# Altium schematic sheet Micro.SchDoc
size A4; SheetNumber: 7
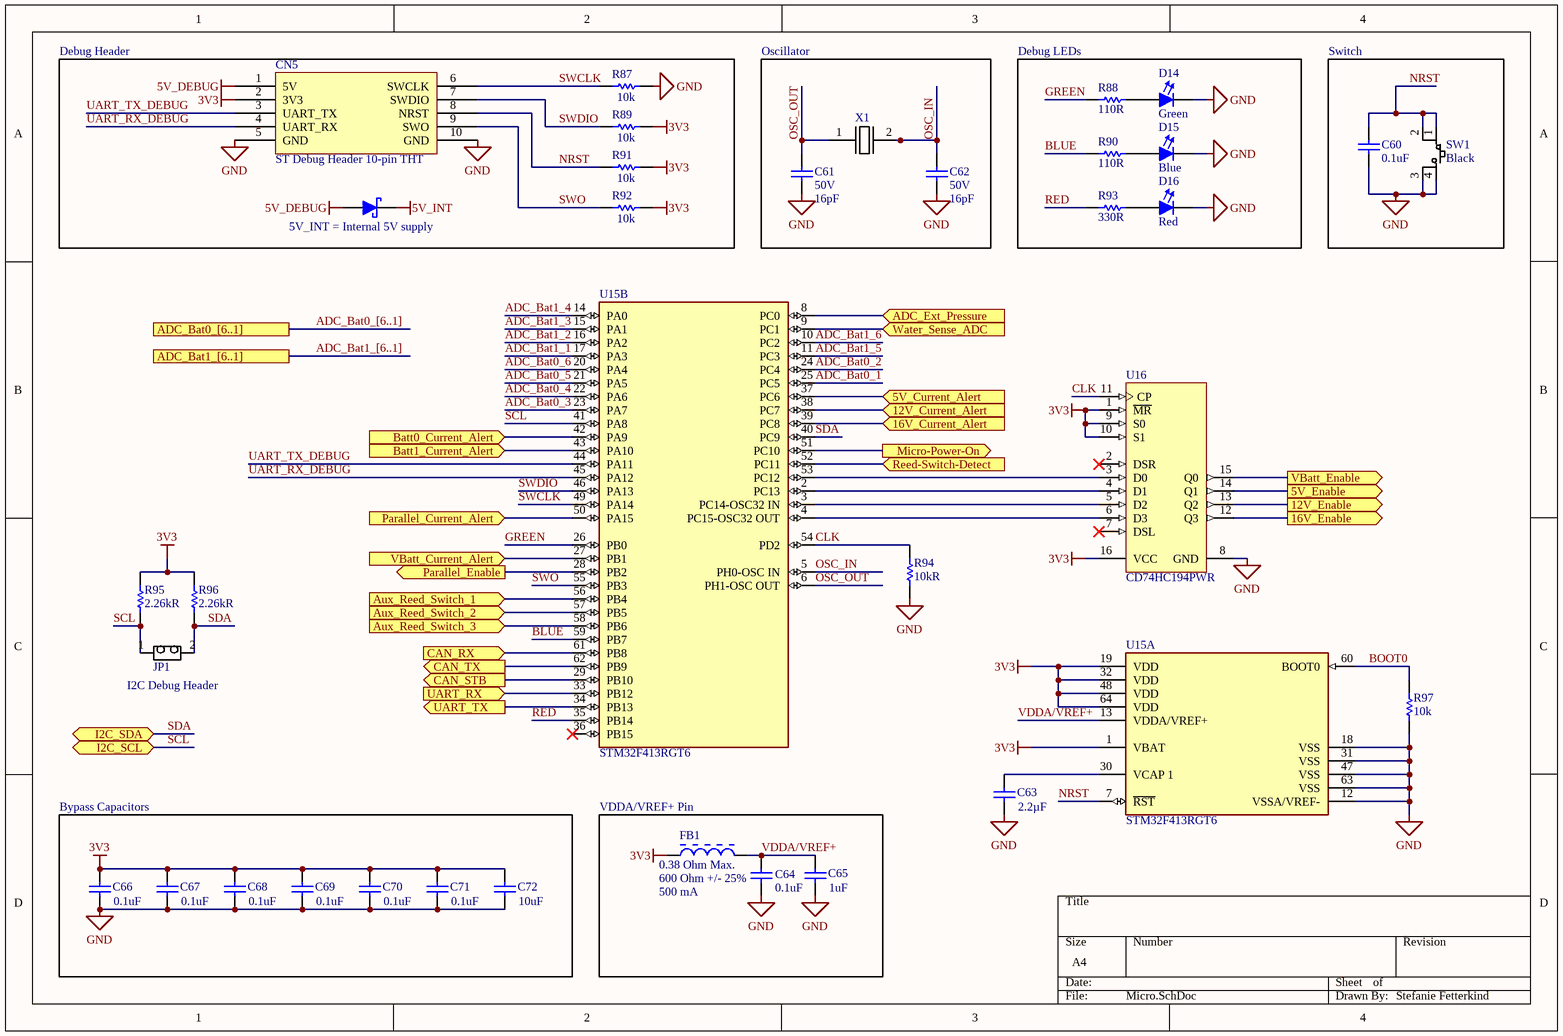
[diagram p0: Micro.SchDoc]

## Parts
C60  Capacitance: 0.1uF  [FP-CL10-0_1-IPC_A]  (hidden comment: CL10B104JB8NNNC)
C61  Voltage: 50V  Capacitance: 16pF  [CAPC1608X90X35LL10T15]  (hidden comment: 16pF Ceramic 50V 5% 0603)
C62  Voltage: 50V  Capacitance: 16pF  [CAPC1608X90X35LL10T15]  (hidden comment: 16pF Ceramic 50V 5% 0603)
C63  value 2.2µF  [CAPC1608N(0603")]  (hidden comment: 2.2uF, 50V, 0603 SMD, X5R, Ceramic)
C64  Capacitance: 0.1uF  [FP-CL10-0_1-IPC_A]  (hidden comment: CL10B104JB8NNNC)
C65  Capacitance: 1uF  [0803 CAP]  (hidden comment: CL21B105KBFNNNG)
C66  Capacitance: 0.1uF  [FP-CL10-0_1-IPC_A]  (hidden comment: CL10B104JB8NNNC)
C67  Capacitance: 0.1uF  [FP-CL10-0_1-IPC_A]  (hidden comment: CL10B104JB8NNNC)
C68  Capacitance: 0.1uF  [FP-CL10-0_1-IPC_A]  (hidden comment: CL10B104JB8NNNC)
C69  Capacitance: 0.1uF  [FP-CL10-0_1-IPC_A]  (hidden comment: CL10B104JB8NNNC)
C70  Capacitance: 0.1uF  [FP-CL10-0_1-IPC_A]  (hidden comment: CL10B104JB8NNNC)
C71  Capacitance: 0.1uF  [FP-CL10-0_1-IPC_A]  (hidden comment: CL10B104JB8NNNC)
C72  Capacitance: 10uF  [CAPC3216X180X50ML20T30]  (hidden comment: CL31B106KBHNNNE)
CN5  ST Debug Header 10-pin THT  [10-pin shrouded header THT]
D14  Color: Green  [FP-LB_Q39E-MFG]  (hidden comment: LT Q39G-Q1OO-25-1)
D15  Color: Blue  [FP-LB_Q39E-MFG]  (hidden comment: LBQ39E-N1OO-35-1)
D16  Color: Red  [FP-LB_Q39E-MFG]  (hidden comment: LSQ976-NR-1)
D17  CUS08F30,H3F  [SC-76]  (value not drawn)
FB1  DC Resistance: 0.38 Ohm Max.  Impedance (at 100 MHz): 600 Ohm +/- 25%  Rated Current: 500 mA  [MURA-BLM18-F-H1-CHIP-2_V]  (hidden comment: BLM18AG601SN1D)
JP1  1x2 Male Header  [2X1 Males Header]  (value not drawn)
R87  value 10k  [RESC1608N(0603")]  (hidden comment: 10kR, 1%, 1/10W, 0603 SMD)
R88  Resistance: 110R  [RESC1608X55X25ML10T15]  (hidden comment: RC0603FR-07110RL)
R89  value 10k  [RESC1608N(0603")]  (hidden comment: 10kR, 1%, 1/10W, 0603 SMD)
R90  Resistance: 110R  [RESC1608X55X25ML10T15]  (hidden comment: RC0603FR-07110RL)
R91  value 10k  [RESC1608N(0603")]  (hidden comment: 10kR, 1%, 1/10W, 0603 SMD)
R92  value 10k  [RESC1608N(0603")]  (hidden comment: 10kR, 1%, 1/10W, 0603 SMD)
R93  Resistance: 330R  [FP-CRCW0603-e3-IPC_A]  (hidden comment: CRCW0603330RFKEA)
R94  Resistance: 10kR  [RESC1608X55X25ML10T15]  (hidden comment: RC0603FR-0710KL)
R95  Resistance: 2.26kR  [RESC0603(1608)_M]  (hidden comment: RC0603FR-072K26L)
R96  Resistance: 2.26kR  [RESC0603(1608)_M]  (hidden comment: RC0603FR-072K26L)
R97  value 10k  [RESC1608N(0603")]  (hidden comment: 10kR, 1%, 1/10W, 0603 SMD)
SW1  Button Colour: Black  [4-SPST-NO]  (hidden comment: PTS645SL43SMTR92LFS)
U15  STM32F413RGT6  [FP-LQFP64-5W-IPC_A]  (parts A,B of 2)
U16  CD74HC194PWR  [PW0016A_M]
X1  Oscillator 8MHz 40ESR  [HC49/US]  (value not drawn)

## Blocks framed on the sheet
Oscillator: C61 C62 X1
Debug LEDs: D14-D16 R88 R90 R93
Switch: C60 SW1
Bypass Capacitors: C66-C72
VDDA/VREF+ Pin: C64 C65 FB1

## Ports
5V_Current_Alert (in), 5V_Enable (out), 12V_Current_Alert (in), 12V_Enable (out), 16V_Current_Alert (in), 16V_Enable (out), ADC_Bat0_[6..1], ADC_Bat1_[6..1], ADC_Ext_Pressure (in), Aux_Reed_Switch_1 (in), Aux_Reed_Switch_2 (in), Aux_Reed_Switch_3 (in), Batt0_Current_Alert (in), Batt1_Current_Alert (in), CAN_RX (in), CAN_STB (out), CAN_TX (out), I2C_SCL (bidir), I2C_SDA (bidir), Micro-Power-On (out), Parallel_Current_Alert (in), Parallel_Enable (out), Reed-Switch-Detect (in), UART_RX (in), UART_TX (out), VBatt_Current_Alert (in), VBatt_Enable (out), Water_Sense_ADC (in)

## Nets
3V3: C66.1 C67.1 C68.1 C69.1 C70.1 C71.1 C72.2 CN5.2(3V3) FB1.1 R89.2 R91.2 R92.2 R95.2 R96.2 U15.1(VBAT) U15.19(VDD) U15.32(VDD) U15.48(VDD) U15.64(VDD) U16.1(~{MR}) U16.9(S0) U16.10(S1) U16.16(VCC)
5V_DEBUG: CN5.1(5V) D17.A(Anode)
5V_INT: D17.K(Cathode)
GND: C60.2 C61.1 C62.1 C63.1(Anode) C64.2 C65.1 C66.2 C67.2 C68.2 C69.2 C70.2 C71.2 C72.1 CN5.5(GND) CN5.10(GND) D14.1(Cathode) D15.1(Cathode) D16.1(Cathode) R87.2 R94.2 R97.1 SW1.3 SW1.4 U15.12(VSSA/VREF-) U15.18(VSS) U15.31(VSS) U15.47(VSS) U15.63(VSS) U16.8(GND)
5V_Current_Alert: U15.37(PC6) ; port 5V_Current_Alert
5V_Enable: U16.14(Q1) ; port 5V_Enable
12V_Current_Alert: U15.38(PC7) ; port 12V_Current_Alert
12V_Enable: U16.13(Q2) ; port 12V_Enable
16V_Current_Alert: U15.39(PC8) ; port 16V_Current_Alert
16V_Enable: U16.12(Q3) ; port 16V_Enable
ADC_Bat0_1: U15.25(PC5)
ADC_Bat0_2: U15.24(PC4)
ADC_Bat0_3: U15.23(PA7)
ADC_Bat0_4: U15.22(PA6)
ADC_Bat0_5: U15.21(PA5)
ADC_Bat0_6: U15.20(PA4)
ADC_Bat1_1: U15.17(PA3)
ADC_Bat1_2: U15.16(PA2)
ADC_Bat1_3: U15.15(PA1)
ADC_Bat1_4: U15.14(PA0)
ADC_Bat1_5: U15.11(PC3)
ADC_Bat1_6: U15.10(PC2)
ADC_Ext_Pressure: U15.8(PC0) ; port ADC_Ext_Pressure
Aux_Reed_Switch_1: U15.56(PB4) ; port Aux_Reed_Switch_1
Aux_Reed_Switch_2: U15.57(PB5) ; port Aux_Reed_Switch_2
Aux_Reed_Switch_3: U15.58(PB6) ; port Aux_Reed_Switch_3
Batt0_Current_Alert: U15.42(PA9) ; port Batt0_Current_Alert
Batt1_Current_Alert: U15.43(PA10) ; port Batt1_Current_Alert
BLUE: R90.2 U15.59(PB7)
BOOT0: R97.2 U15.60(BOOT0)
CAN_RX: U15.61(PB8) ; port CAN_RX
CAN_STB: U15.29(PB10) ; port CAN_STB
CAN_TX: U15.62(PB9) ; port CAN_TX
CLK: R94.1 U15.54(PD2) U16.11(CP)
GREEN: R88.2 U15.26(PB0)
Micro-Power-On: U15.51(PC10) ; port Micro-Power-On
NRST: C60.1 CN5.8(NRST) R91.1 SW1.1 SW1.2 U15.7(~{RST})
OSC_IN: C62.2 U15.5(PH0-OSC_IN) X1.2
OSC_OUT: C61.2 U15.6(PH1-OSC_OUT) X1.1
Parallel_Current_Alert: U15.50(PA15) ; port Parallel_Current_Alert
Parallel_Enable: U15.28(PB2) ; port Parallel_Enable
RED: R93.1 U15.35(PB14)
Reed-Switch-Detect: U15.52(PC11) ; port Reed-Switch-Detect
SCL: JP1.1 R95.1 U15.41(PA8) ; port I2C_SCL
SDA: JP1.2 R96.1 U15.40(PC9) ; port I2C_SDA
SWCLK: CN5.6(SWCLK) R87.1 U15.49(PA14)
SWDIO: CN5.7(SWDIO) R89.1 U15.46(PA13)
SWO: CN5.9(SWO) R92.1 U15.55(PB3)
UART_RX: U15.33(PB12) ; port UART_RX
UART_RX_DEBUG: CN5.4(UART_RX) U15.45(PA12)
UART_TX: U15.34(PB13) ; port UART_TX
UART_TX_DEBUG: CN5.3(UART_TX) U15.44(PA11)
VBatt_Current_Alert: U15.27(PB1) ; port VBatt_Current_Alert
VBatt_Enable: U16.15(Q0) ; port VBatt_Enable
VDDA/VREF+: C64.1 C65.2 FB1.2 U15.13(VDDA/VREF+)
Water_Sense_ADC: U15.9(PC1) ; port Water_Sense_ADC
NetC63_2: C63.2(Cathode) U15.30(VCAP_1)
NetD14_2: D14.2(Anode) R88.1
NetD15_2: D15.2(Anode) R90.1
NetD16_2: D16.2(Anode) R93.2
NetU15_2: U15.2(PC13) U16.4(D1)
NetU15_3: U15.3(PC14-OSC32_IN) U16.5(D2)
NetU15_4: U15.4(PC15-OSC32_OUT) U16.6(D3)
NetU15_53: U15.53(PC12) U16.3(D0)

Not connected (* = marked no-connect by the designer): U15 36(PB15)*; U16 2(DSR)* 7(DSL)*

## Buses and harness runs
bus ADC_Bat0_[6..1] = port ADC_Bat0_[6..1]
bus ADC_Bat1_[6..1] = port ADC_Bat1_[6..1]

## Notes on the sheet
- Debug Header
- (near D17) 5V_INT = Internal 5V supply
- (near JP1) I2C Debug Header
- Stefanie Fetterkind

## Library data of the parts
C60 = CMP-00000-4: CAP CER 0.1UF 50V X7R 0603; Tolerance: 5%; Material: Ceramic; Case Code (Imperial): 0603; Mount: Surface Mount; Thickness: 0.035inch; Depth: 0.8mm; Packaging: Tape and Reel; Package Quantity: 1; Dielectric: X7R; Height: 0.8mm; Voltage: 50V; Radiation Hardening: No; Max Operating Temperature: 125°C; Voltage Rating: 50V; Case/Package: 0603; Min Operating Temperature: -55°C; Case Code (Metric): 1608; Length: 1.6mm; Contact Plating: Tin; Width: 0.031inch
C61 C62 = CMP-00087-2: Cap Ceramic 16pF 50V C0G 5% SMD 0603 125C Paper T/R; Temperature Coefficient: 30ppm/°C; Termination: SMD/SMT; Voltage Rating: 50V; Dielectric: C0G; Radiation Hardening: No; Voltage Rating (DC): 50V; Max Operating Temperature: 125°C; Height: 0.8mm; Width: 0.8mm; Length: 1.6mm; Package Quantity: 1; Lead Free: Lead Free; Min Operating Temperature: -55°C; Case Code (Metric): 1608; Case/Package: 0603; Tolerance: 5%; Mount: Surface Mount; Thickness: 0.035inch; Case Code (Imperial): 0603; Depth: 0.8mm; Packaging: Tape and Reel
C63 = CMP-006-0030-1: Capacitor, Ceramic, 50V, 10%, 0603 SMD, X5R; Date Created: *; Design Item ID: 2.2uF, 50V, 0603 SMD, X5R, Ceramic; Made By: *; Publisher: AUVic; Source: AUVic_Schematic_Library_Capacitors.SchLib; Pin Count: 2; PackageDescription: Chip Capacitor; Component Type: Standard
C64 C66-C71 = CMP-00000-4: CAP CER 0.1UF 50V X7R 0603; Material: Ceramic; Tolerance: 5%; Dielectric: X7R; Width: 0.031inch; Min Operating Temperature: -55°C; Contact Plating: Tin; Length: 1.6mm; Case/Package: 0603; Package Quantity: 1; Voltage Rating: 50V; Voltage: 50V; Radiation Hardening: No; Packaging: Tape and Reel; Max Operating Temperature: 125°C; Case Code (Imperial): 0603; Thickness: 0.035inch; Case Code (Metric): 1608; Height: 0.8mm; Mount: Surface Mount; Depth: 0.8mm
C65 = CMP-00005-3: SAMSUNG ELECTRO-MECHANICS - CL21B105KBFNNNG - MLCC CAPACITORS; Tolerance: 10%; Voltage Rating: 50V; Material: Ceramic; Dielectric: X7R; Case/Package: 0805; Contact Plating: Tin; Max Operating Temperature: 125°C; Termination: Wraparound; Package Quantity: 3000; Depth: 1.25mm; Mount: Surface Mount; Min Operating Temperature: -55°C; Thickness: 0.053inch; Packaging: Tape and Reel; Voltage: 50V; Case Code (Metric): 2012; Length: 2mm; Case Code (Imperial): 0805; Width: 0.049inch
C72 = CMP-00004-2: Cap Ceramic 10uF 50V X7R 10% Pad SMD 1206 125°C T/R; Thickness: 0.071inch; Case/Package: 1206; Case Code (Metric): 3216; Case Code (Imperial): 1206; Voltage Rating: 50V; Length: 0.126inch; Max Operating Temperature: 125°C; Voltage Rating (DC): 50V; Dielectric: X7R; Lead Free: Lead Free; Min Operating Temperature: -55°C; Tolerance: 10%; Mount: Surface Mount; Packaging: Tape and Reel; Width: 0.063inch
CN5 = CMP-00011-6: CONN HEADER VERT 10POS 2.54MM; Row Spacing: 0.1inch; Connector Type: Male Pin; Number of Positions: 10; Packaging: Tray; Package Quantity: 1; Color: Black; Number of Rows: 2; Termination: Solder; Contact Plating: Gold; Lead Free: Lead Free; Pitch: 0.1inch; Mount: Through Hole
D14 = CMP-00064-3: LED GREEN DIFFUSED 0603 SMD; Dominant Wavelength: 530nm; Luminous Intensity: 280mcd; Lens Style: Diffused,Colorless,Rectangular; Number of LEDs: 1; Forward Voltage: 2.85V; Test Current: 5mA; Reverse Voltage: 5V; Forward Current: 15mA; Luminous Flux: 0.55lm; Radiation Hardening: No; Packaging: Tape and Reel; Mount: Surface Mount; Max Operating Temperature: 85°C; Number of Elements: 1; Number of Pins: 2; Min Operating Temperature: -40°C; Depth: 0.9mm; Case/Package: SMD/SMT; Length: 1.7mm
D15 = CMP-00063-3: LED BLUE DIFFUSED 0603 SMD; Luminous Flux: 0.13lm; Lens Size: 0.8mm; Lens Color: White; Viewing Angle: 130°; Luminous Intensity: 42mcd; Number of LEDs: 1; Dominant Wavelength: 470nm; Lens Style: Flat,Diffused,Colorless,Rectangular; Test Current: 5mA; Forward Voltage: 2.85V; Packaging: Tape and Reel; Case/Package: 0603; Height: 0.4mm; Number of Pins: 2; Mount: Surface Mount; Case Code (Metric): 1608; Case Code (Imperial): 0603; Lens Transparency: Diffused; Width: 0.8mm; Length: 1.6mm; Radiation Hardening: No
D16 = CMP-00066-2: LED Red 645nm 2-Pin Chip 0603(1608Metric) T/R; Lens Transparency: Diffused; Power Dissipation: 65mW; Forward Voltage: 2.5V; Dominant Wavelength: 633nm; Number of Elements: 1; Lens Style: Diffused,Flat,Colorless,Rectangular; Lens Color: White; Viewing Angle: 160°; Luminous Flux: 0.33lm; Test Current: 20mA; Forward Current: 25mA; Luminous Intensity: 180mcd; Reverse Voltage: 12V; Lens Size: 0.8mm; Max Operating Temperature: 85°C; Depth: 0.9mm; Illumination Color: Red; Packaging: Tape and Reel; Min Operating Temperature: -30°C; Case Code (Imperial): 0603; Case Code (Metric): 1608; Number of Pins: 2; Mount: Surface Mount; Height: 0.8mm; Package Quantity: 1; Length: 1.7mm; Width: 0.8mm; Number of LEDs: 1; Case/Package: 0603; Radiation Hardening: No
D17 = CMP-057-0000-2: Diode Schottky 30V 800mA Surface Mount USC; Peak Non-Repetitive Surge Current: 5A; Element Configuration: Single; Peak Reverse Current: 50uA; Packaging: Tape and Reel; Mount: Surface Mount; Average Rectified Current: 800mA; Case/Package: SOD; Max Reverse Voltage (DC): 30V; Min Operating Temperature: -55°C; Contact Plating: Tin,Silver; Max Repetitive Reverse Voltage (Vrrm): 30V; Number of Pins: 2; Max Operating Temperature: 125°C
FB1 = CMP-0686-00436-2: Chip Ferrite Bead for General Use, 600 Ohm, 500 mA, -55 to 125 degC, 1.6 x 0.8 x 0.95 mm SMD, Tape and Reel; Manufacturer: Murata; ComponentLink3Description: Package Specification; ComponentLink1Description: Manufacturer URL; ComponentLink1URL: http://www.murata.com/; DatasheetVersion: 08/2013; ComponentLink2URL: http://www.murata.com/products/catalog/pdf/c31e.pdf; PackageReference: BLM18_H950-2; PackageDescription: 2-Pin Chip, Body 1.6 x 0.8 mm; PartNumber: BLM18AG601SN1D; Mounting Technology: Surface Mount; ComponentLink2Description: Datasheet; Packing: Tape and Reel; ComponentLink3URL: http://www.murata.com/products/catalog/pdf/c31e.pdf; Operating Temperature Range: -55 to 125 degC
JP1 = CMP-004-0001-1: Made By: Andy Bates; Source: AUVic_Schematic_Library_Connectors.SchLib; Pin Count: 2; Design Item ID: 1x2 Male Header; Component Type: Standard
R87 R89 R91 R92 R97 = CMP-047-0013-1: Owned By: AUVic; Made By: Ashwin Sira; Design Item ID: 10kR, 1%, 1/10W, 0603 SMD; Pin Count: 2; Component Type: Standard; Created On: 14-05-31; Last Edited: 14-05-31; Source: AUVic_Schematic_Library_Resistors.SchLib
R88 R90 = CMP-00069-2: RES SMD 110 OHM 1% 1/10W 0603; Max Power Dissipation: 100mW; Voltage Rating (DC): 50V; Temperature Coefficient: 100ppm/°C; Working Voltage: 75V; Military Standard: Not; Termination: SMD/SMT; Number of Terminations: 2; Features: Moisture Resistant; Min Operating Temperature: -55°C; Power Rating: 100mW; Height: 0.022inch; Package Quantity: 1; Lead Free: Lead Free; Tolerance: 1%; Voltage Rating: 50V; Composition: Thick Film; Case Code (Imperial): 0603; Length: 1.6mm; Packaging: Tape and Reel; Case Code (Metric): 1608; Max Operating Temperature: 155°C; Depth: 0.8mm; Case/Package: 0603; Width: 0.031inch
R93 = CMP-00067-3: Res Thick Film 0603 330 Ohm 1% 0.1W(1/10W) +/-100ppm/ßC Pad SMD Automotive T/R; Power Rating: 100mW; Temperature Coefficient: 100ppm/°C; Voltage Rating (DC): 75V; Packaging: Tape and Reel; Features: Automotive AEC-Q200; Case Code (Imperial): 0603; Width: 0.033inch; Length: 1.55mm; Min Operating Temperature: -55°C; Mount: Surface Mount; Contact Plating: Tin; Number of Terminations: 2; Depth: 0.85mm; Package Quantity: 10; Radiation Hardening: No; Case Code (Metric): 1608; Military Standard: Not; Height: 0.45mm; Max Power Dissipation: 100mW; Case/Package: 0603; Weight: 7.1E-05oz; Voltage Rating: 75V; Tolerance: 1%; Max Operating Temperature: 155°C; Lead Free: Lead Free; Termination: SMD/SMT; Composition: Thick Film; REACH SVHC: Unknown
R94 = CMP-00037-2: Res General Purpose Thick Film 0603 10K Ohm 1% 1/10W ±100ppm/°C Molded SMD Paper T/R; Voltage Rating (DC): 50V; Power Rating: 100mW; Voltage Rating: 75V; Case Code (Imperial): 0603; Temperature Coefficient: 100ppm/°C; Tolerance: 1%; Military Standard: Not; Depth: 0.8mm; Min Operating Temperature: -55°C; Width: 0.8mm; Composition: Thick Film; Packaging: Tape and Reel; REACH SVHC: No SVHC; Max Operating Temperature: 155°C; Case Code (Metric): 1608; Case/Package: 0603; Length: 1.6mm; Number of Pins: 2; Lead Free: Lead Free; Height: 0.45mm; Termination: SMD/SMT; Weight: 7.1E-05oz; Lead Pitch: 0.3mm
R95 R96 = CMP-00074-2: RES SMD 2.26K OHM 1% 1/10W 0603; Voltage Rating: 50V; Max Power Dissipation: 100mW; Temperature Coefficient: 100ppm/°C; Case/Package: 0603; Height: 0.022inch; Tolerance: 1%; Package Quantity: 1; Depth: 0.8mm; Case Code (Metric): 1608; Number of Terminations: 2; Max Operating Temperature: 155°C; Termination: SMD/SMT; Packaging: Tape and Reel; Case Code (Imperial): 0603; Width: 0.8mm; Length: 1.6mm; Power Rating: 100mW; Military Standard: Not; Composition: Thick Film; Min Operating Temperature: -55°C; Voltage Rating (DC): 50V; Lead Free: Lead Free; Features: Moisture Resistant
SW1 = CMP-00077-1: Black Switch Tactile N.O. SPST Round Button Gull Wing 0.05A 12VDC 100000Cycles 1.27N SMD T/R; Actuator Material: Nylon,Polyamide; Switch Function: Off-Mom; Actuator Type: Standard; Illumination Type: Non-Illuminated; Max Voltage Rating (DC): 12V; Current Rating: 50mA; Actuator Length: 0.85mm; Contact Resistance: 100mR; Depth: 9mm; Length: 6mm; Termination: Gull Wing; Max Operating Temperature: 60°C; Mechanical Life: 100000Cycles; Packaging: Tape and Reel; Color: Black; Throw Configuration: SPST; Min Operating Temperature: -20°C; Mount: Surface Mount; Lead Free: Lead Free; Operating Force: 1.27N; Contact Material: Bronze,Brass,Silver; Max Current Rating: 50mA; Package Quantity: 1000; Voltage Rating (DC): 12V; Contact Plating: Silver; Orientation: Straight
U15 = CMP-00006-2: STMICROELECTRONICS - STM32F413RGT6 - MCU, ARM CORTEX-M4, 100MHZ, LQFP-64; Number of I/Os: 50; Oscillator Type: Internal; Peripherals: Brown-out Detect/Reset,POR,PWM,WDT,DMA,LCD; Interface: I2C,SPI,USB,IrDA,MMC,SDIO,UART,USART; Memory Type: FLASH; Memory Size: 1MB; Case/Package: LQFP; Packaging: Tray; Core Architecture: ARM; Min Operating Temperature: -40°C; Max Operating Temperature: 85°C; Frequency: 100MHz
U16 = CMP-00057-1: IC SHFT REGSTR UNIV BIDIR16TSSOP; Direction: Bidirectional; Min Supply Voltage: 2V; Logic Function: Shift Register; Turn-On Delay Time: 265ns; Propagation Delay: 30ns; Operating Supply Voltage: 5V; Number of Circuits: 1; Quiescent Current: 8uA; Number of Bits per Element: 4; Max Supply Voltage: 6V; Number of Input Lines: 6; Lead Free: Lead Free; Max Operating Temperature: 125°C; Number of Pins: 16; Min Operating Temperature: -55°C; Packaging: Tape and Reel; Weight: 0.002183oz; Case/Package: TSSOP; Number of Elements: 1; Mount: Surface Mount; Contact Plating: Gold; Number of Bits: 4; Number of Output Lines: 4; Package Quantity: 2000
X1 = CMP-043-0007-1: 8Mhz 40ESR  16pF -20°C ~ 70°C; Made By: Lyden Smith; Date Made: 2017-09-18; Component Type: Standard; Source: AUVic_Schematic_Library_Oscillators.SchLib; Pin Count: 2; Design Item ID: Oscillator 8MHz 40ESR